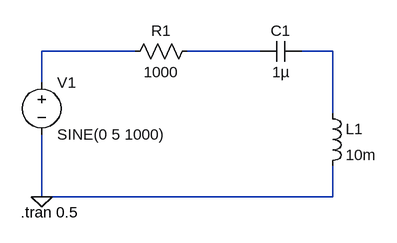
[diagram p0: schematic LCR_Circuit.asc]
LCR_Circuit.asc, the LTspice schematic file:
Version 4.1
SHEET 1 880 680
WIRE 80 64 -64 64
WIRE 272 64 160 64
WIRE 384 64 336 64
WIRE -64 112 -64 64
WIRE 384 160 384 64
WIRE -64 288 -64 192
WIRE 384 288 384 240
WIRE 384 288 -64 288
FLAG -64 288 0
SYMBOL voltage -64 96 R0
WINDOW 123 0 0 Left 0
WINDOW 39 0 0 Left 0
SYMATTR InstName V1
SYMATTR Value SINE(0 5 1000)
SYMBOL res 176 48 R90
WINDOW 0 0 56 VBottom 2
WINDOW 3 32 56 VTop 2
SYMATTR InstName R1
SYMATTR Value 1000
SYMBOL cap 336 48 R90
WINDOW 0 0 32 VBottom 2
WINDOW 3 32 32 VTop 2
SYMATTR InstName C1
SYMATTR Value 1µ
SYMBOL ind 368 144 R0
SYMATTR InstName L1
SYMATTR Value 10m
TEXT -96 312 Left 2 !.tran 0.5

The netlist it stands for:
* LCR_Circuit.asc
V1 N001 0 SINE(0 5 1000)
R1 N002 N001 1000
C1 N003 N002 1µ
L1 N003 0 10m
.tran 0.5
.backanno
.end